# Altium schematic sheet PowerManagement_uC.SchDoc: Power Management uC
size A3; DrawnBy: Fabian Niederberger; Engineer: Fabian Niederberger; Organization: HSLU T&A; Address1: Abteilung Elektrotechnik; Address2: Technikumsstrasse 21; Address3: CH-6048 Horw; DocumentNumber: 2; Revision: 1.0; SheetNumber: 2; SheetTotal: 3; Projektname: PREN2 Team 10; pcbDesigner: Fabian Niederberger; DocumentName: Power Management uC; ProjectName: PREN2 Team 10
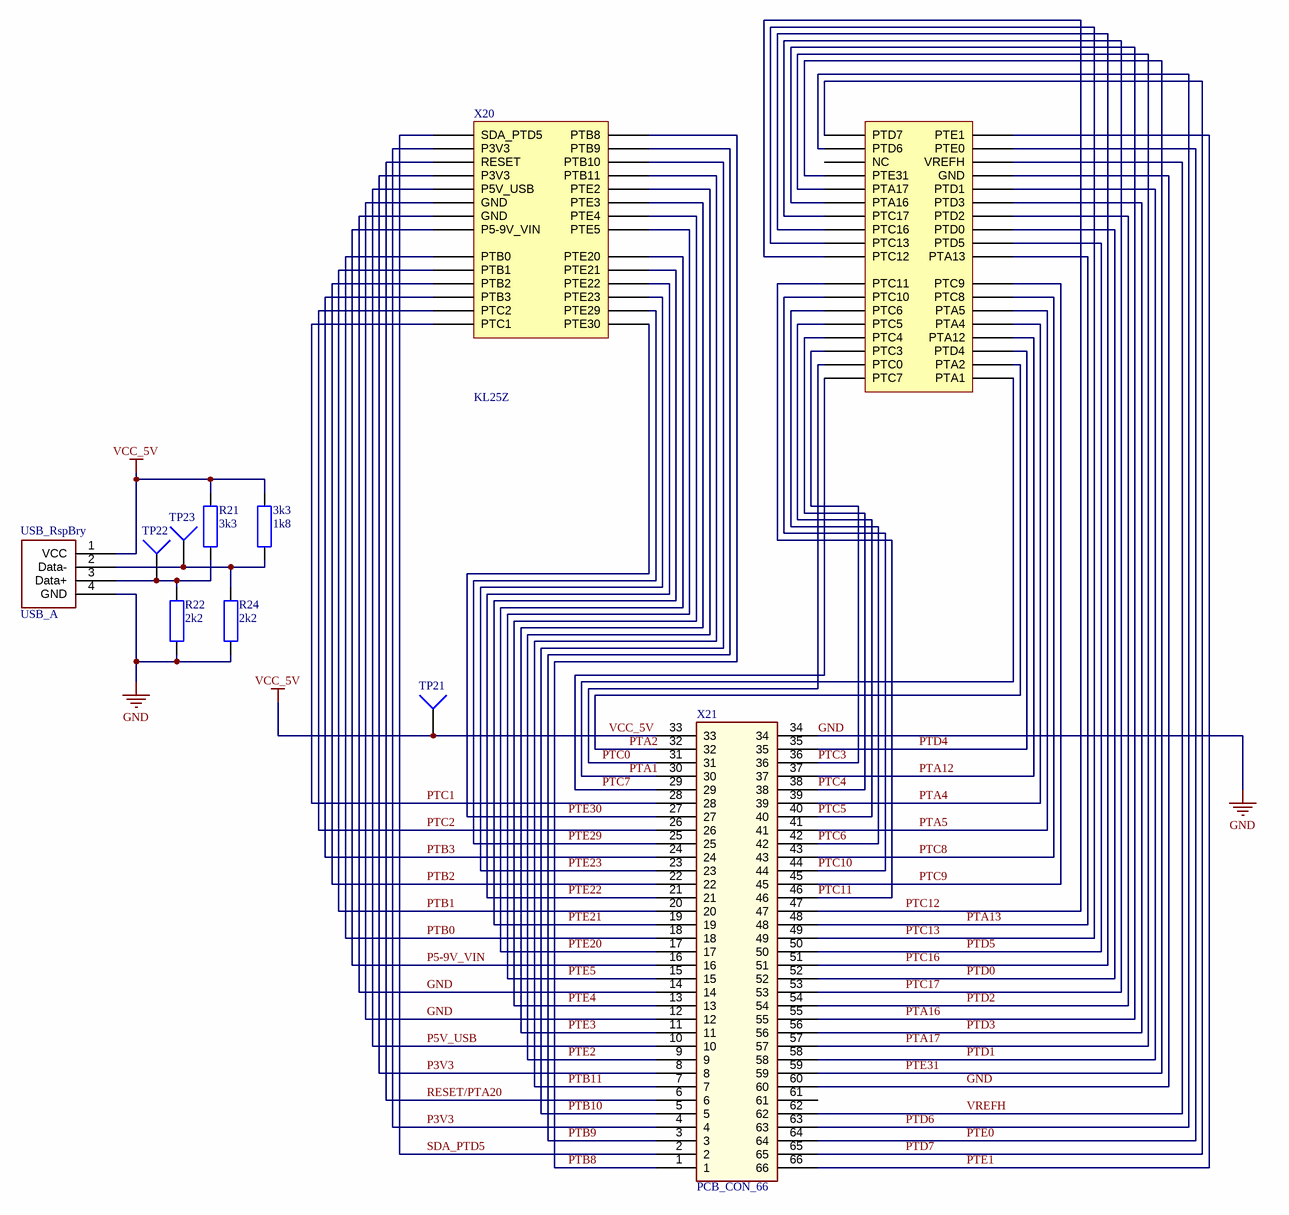
[diagram p0: PowerManagement_uC.SchDoc]

## Parts
3k3  1k8  [0805]
R21  3k3  [0805]
R22  2k2  [0805]
R24  2k2  [0805]
TP21  (no value)  [PIN1]
TP22  (no value)  [PIN1]
TP23  (no value)  [PIN1]
USB_RspBry  USB_A  [USB_A]
X20  KL25Z  [Freedom KL25Z Headerarray]
X21  PCB_CON_66  [PCB_CON_66_PLUG]

## Nets
GND: R22.1 R24.1 USB_RspBry.4(GND) X20.11(GND) X20.13(GND) X20.36(GND) X21.12 X21.14 X21.34 X21.60
VCC_5V: 3k3.2 R21.2 TP21.1 USB_RspBry.1(VCC) X21.33
P3V3: X20.3(P3V3) X20.7(P3V3) X21.4 X21.8
P5-9V_VIN: X20.15(P5-9V_VIN) X21.16
P5V_USB: X20.9(P5V_USB) X21.10
PTA1: X20.64(PTA1) X21.30
PTA2: X20.62(PTA2) X21.32
PTA4: X20.56(PTA4) X21.39
PTA5: X20.54(PTA5) X21.41
PTA12: X20.58(PTA12) X21.37
PTA13: X20.48(PTA13) X21.48
PTA16: X20.39(PTA16) X21.55
PTA17: X20.37(PTA17) X21.57
PTB0: X20.17(PTB0) X21.18
PTB1: X20.19(PTB1) X21.20
PTB2: X20.21(PTB2) X21.22
PTB3: X20.23(PTB3) X21.24
PTB8: X20.2(PTB8) X21.1
PTB9: X20.4(PTB9) X21.3
PTB10: X20.6(PTB10) X21.5
PTB11: X20.8(PTB11) X21.7
PTC0: X20.61(PTC0) X21.31
PTC1: X20.27(PTC1) X21.28
PTC2: X20.25(PTC2) X21.26
PTC3: X20.59(PTC3) X21.36
PTC4: X20.57(PTC4) X21.38
PTC5: X20.55(PTC5) X21.40
PTC6: X20.53(PTC6) X21.42
PTC7: X20.63(PTC7) X21.29
PTC8: X20.52(PTC8) X21.43
PTC9: X20.50(PTC9) X21.45
PTC10: X20.51(PTC10) X21.44
PTC11: X20.49(PTC11) X21.46
PTC12: X20.47(PTC12) X21.47
PTC13: X20.45(PTC13) X21.49
PTC16: X20.43(PTC16) X21.51
PTC17: X20.41(PTC17) X21.53
PTD0: X20.44(PTD0) X21.52
PTD1: X20.38(PTD1) X21.58
PTD2: X20.42(PTD2) X21.54
PTD3: X20.40(PTD3) X21.56
PTD4: X20.60(PTD4) X21.35
PTD5: X20.46(PTD5) X21.50
PTD6: X20.31(PTD6) X21.63
PTD7: X20.29(PTD7) X21.65
PTE0: X20.32(PTE0) X21.64
PTE1: X20.30(PTE1) X21.66
PTE2: X20.10(PTE2) X21.9
PTE3: X20.12(PTE3) X21.11
PTE4: X20.14(PTE4) X21.13
PTE5: X20.16(PTE5) X21.15
PTE20: X20.18(PTE20) X21.17
PTE21: X20.20(PTE21) X21.19
PTE22: X20.22(PTE22) X21.21
PTE23: X20.24(PTE23) X21.23
PTE29: X20.26(PTE29) X21.25
PTE30: X20.28(PTE30) X21.27
PTE31: X20.35(PTE31) X21.59
RESET/PTA20: X20.5(RESET) X21.6
SDA_PTD5: X20.1(SDA_PTD5) X21.2
VREFH: X20.34(VREFH) X21.62
Net3k3_1: 3k3.1 R24.2 TP23.1 USB_RspBry.2(Data-)
NetR21_1: R21.1 R22.2 TP22.1 USB_RspBry.3(Data+)

Not connected (* = marked no-connect by the designer): X20 33(NC); X21 61

## Notes on the sheet
- Project:
- Drawn by:
- Size:
- Sheet
- A3
- Rev.:
- of
- Date:
- File:

## Library data of the parts
3k3 R21 R22 R24 = R?: Normaler Widerstand
TP21-TP23 = Socket: LatestRevisionDate: 17-Jul-2002; LatestRevisionNote: Re-released for DXP Platform.; Publisher: Altium Limited
X20 = Freedom KL25Z Header: FRDM KL25Z Shield
X21 = PCB_CON_66: Connects a PCB with another. This scheme is either jack or plug, depends on footprint